# EAGLE schematic GDT_DRIVER (EAGLE 7.2.0)
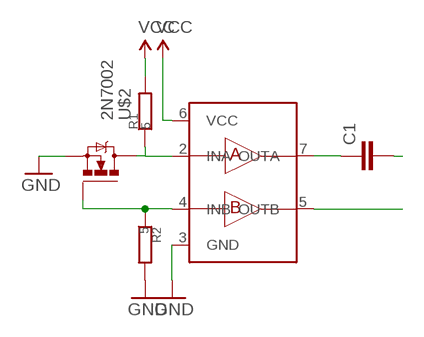
[diagram p0: schematic, sheet 1]

## Parts
C1  CAP1210  [1210]
R1  5  R0805  [R0805]
R2  5  R0805  [R0805]
U$1  INDN602  [SO08]
U$2  2N7002  [SOT23]

## Nets
GND: R2.2 U$1.3(GND) U$2.2(S)
N$1: R1.1 U$1.2(INA) U$2.3(D)
N$2: R2.1 U$1.4(INB) U$2.1(G)
N$4: C1.1 U$1.7(OUTA)
N$5: U$1.5(OUTB)
N$6: C1.2
VCC: R1.2 U$1.6(VCC)

## Library data of the parts
C1 = SparkFun-Capacitors:CAP: Capacitor Standard 0603 ceramic capacitor, and 0.1" leaded capacitor.
R1 R2 = CasaLibrary:R
U$1 = CasaLibrary:INDN602
U$2 = CasaLibrary:2N7002